# Altium schematic sheet V1.0.SchDoc
size 71 x 38 mm
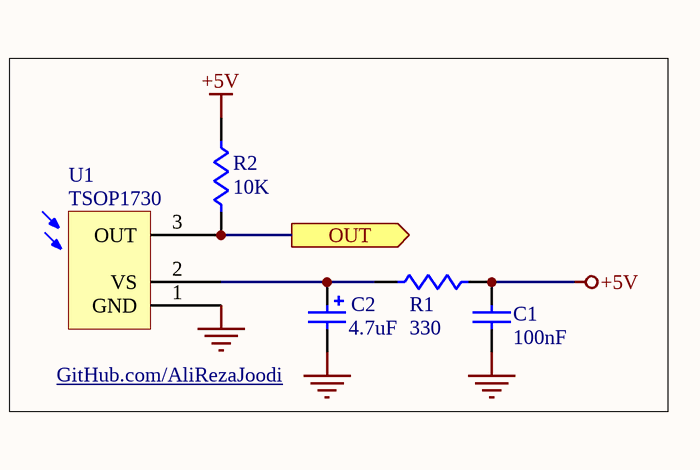
[diagram p0: V1.0.SchDoc]

## Parts
C1  100nF  [CAPNTO2.54-3.05x1.78A]
C2  4.7uF  [CAPPR2.5-6.3x5]
R1  330  [AXIAL-0.4]
R2  10K  [AXIAL-0.4]
U1  TSOP1730  [IR10]

## Ports
OUT (out)

## Nets
+5V: C1.2 R1.1 R2.1
GND: C1.1 C2.2 U1.1(GND)
OUT: R2.2 U1.3(OUT) ; port OUT
NetC2_1: C2.1 R1.2 U1.2(VS)

## Notes on the sheet
- GitHub.com/AliRezaJoodi

## Library data of the parts
C1 = Cap: Capacitor; Manufacturer: Generic Components; Class I: Passive; Published: 8-Jun-2000; Revision: July-2002: Re-released for DXP Platform.; Publisher: Altium Limited; Class II: Capacitor
C2 = Cap Pol1: Polarized Capacitor (Radial); Manufacturer: Generic Components; Class I: Passive; Published: 8-Jun-2000; Revision: July-2002: Re-released for DXP Platform.; Publisher: Altium Limited; Class II: Capacitor
R1 R2 = Res1: Resistor; Manufacturer: Generic Components; Class I: Passive; Published: 8-Jun-2000; Revision: July-2002: Re-released for DXP Platform.; Publisher: Altium Limited; Class II: Resistor
U1 = IR Module: IR receiver module for remote control